# Altium schematic sheet 电子脚铐便携式主控板-APC340.SchDoc
size A4
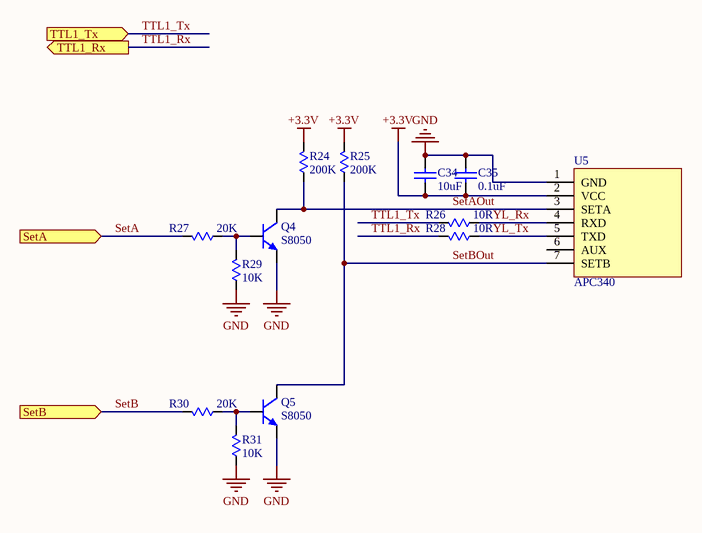
[diagram p0: 电子脚铐便携式主控板-APC340.SchDoc]

## Parts
C34  10uF  [C0603]
C35  0.1uF  [C0603]
Q4  S8050  [SOT-23]
Q5  S8050  [SOT-23]
R24  200K  [R0603]
R25  200K  [R0603]
R26  value 10R  [R0603]  (hidden comment: 200K)
R27  value 20K  [R0603]  (hidden comment: 200K)
R28  value 10R  [R0603]  (hidden comment: 200K)
R29  10K  [R0603]
R30  value 20K  [R0603]  (hidden comment: 200K)
R31  10K  [R0603]
U5  APC340  [APC340]

## Ports
SetA (in), SetB (in), TTL1_Rx (out), TTL1_Tx (in)

## Nets
+3.3V: C34.1 C35.1 R24.2 R25.2 U5.2(VCC)
GND: C34.2 C35.2 Q4.2(e) Q5.2(e) R29.1 R31.1 U5.1(GND)
SetA: R27.2 ; port SetA
SetAOut: Q4.3(c) R24.1 U5.3(SETA)
SetB: R30.2 ; port SetB
SetBOut: Q5.3(c) R25.1 U5.7(SETB)
TTL1_Rx: R28.2 ; port TTL1_Rx
TTL1_Tx: R26.2 ; port TTL1_Tx
YL_Rx: R26.1 U5.4(RXD)
YL_Tx: R28.1 U5.5(TXD)
NetQ4_1: Q4.1(b) R27.1 R29.2
NetQ5_1: Q5.1(b) R30.1 R31.2

Not connected (* = marked no-connect by the designer): U5 6(AUX)

## Notes on the sheet
- 文件名:
- 审核:
- 制图人:
- 孟浩
- 校对:
- 图号:
- 批准:
- 日期:

## Library data of the parts
C34 C35 = CAP: Published: 8-Jun-2000; LatestRevisionDate: 17-Jul-2002; LatestRevisionNote: Re-released for DXP Platform.; PackageReference: RAD-0.3; Publisher: Altium Limited
  C34: Value: 10uF
  C35: Value: 0.1uF
Q4 Q5 = S8050: NPN triode, 0.5A Max
R24-R31 = RES: Resistor; Published: 8-Jun-2000; LatestRevisionDate: 17-Jul-2002; LatestRevisionNote: Re-released for DXP Platform.; PackageReference: AXIAL-0.3; Publisher: Altium Limited
  R24 R25: Value: 200K
  R29 R31: Value: 10K